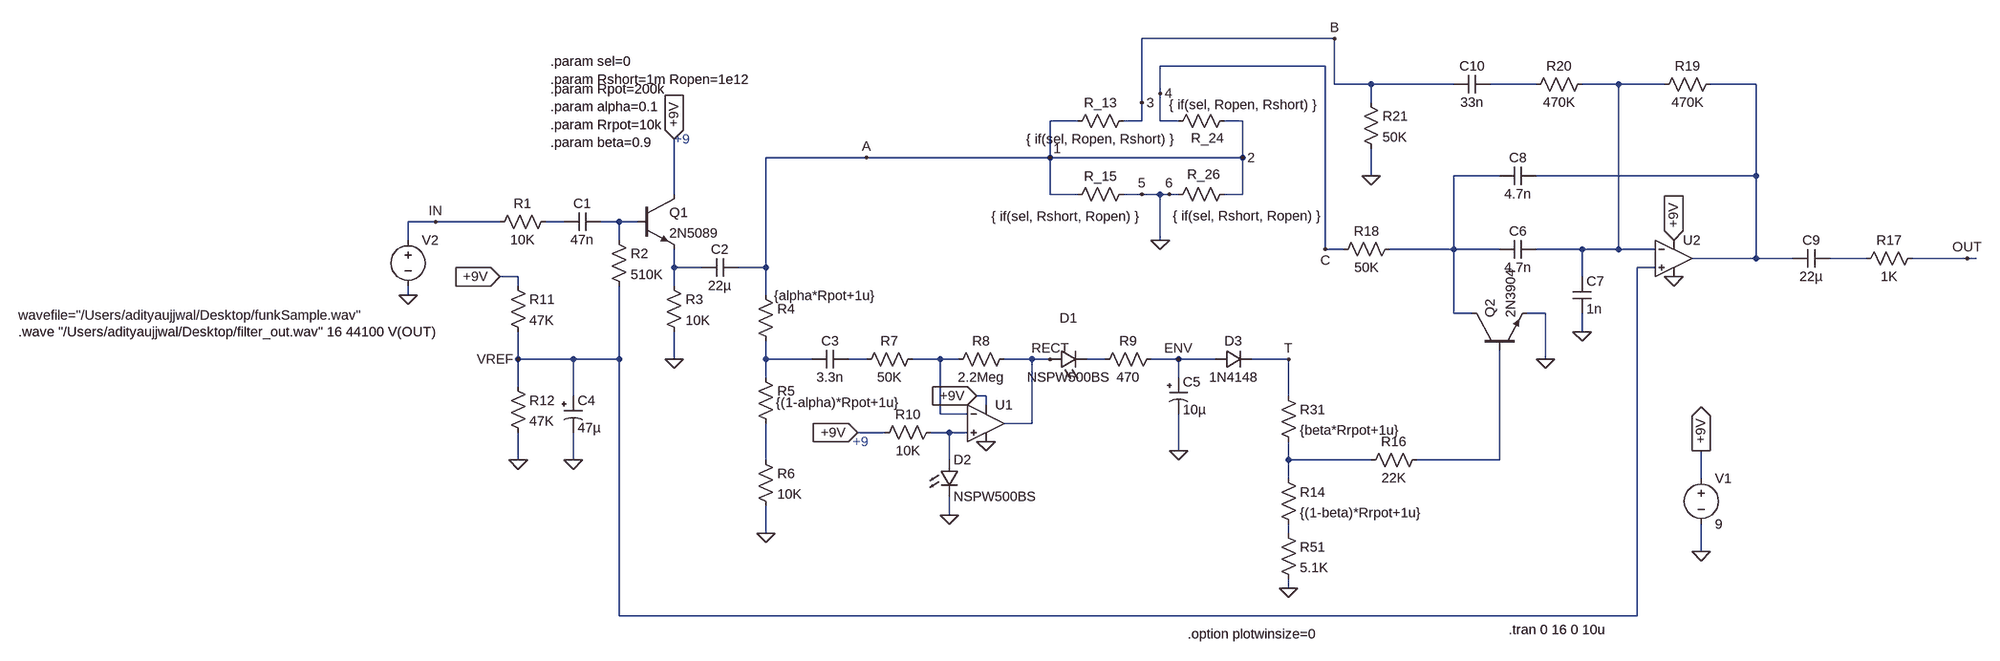
[diagram p0: schematic finalEnvelopeFilterPedal_LTSpice.asc]
finalEnvelopeFilterPedal_LTSpice.asc, the LTspice schematic file:
Version 4
SHEET 1 2632 932
WIRE 1456 -224 1120 -224
WIRE 1440 -176 1152 -176
WIRE 1456 -144 1456 -224
WIRE 1520 -144 1456 -144
WIRE 1664 -144 1520 -144
WIRE 1808 -144 1728 -144
WIRE 1952 -144 1888 -144
WIRE 2032 -144 1952 -144
WIRE 2192 -144 2112 -144
WIRE 1152 -128 1152 -176
WIRE 1120 -112 1120 -224
WIRE 1520 -112 1520 -144
WIRE 1008 -80 960 -80
WIRE 1120 -80 1120 -112
WIRE 1120 -80 1088 -80
WIRE 1152 -80 1152 -128
WIRE 1184 -80 1152 -80
WIRE 1296 -80 1264 -80
WIRE 640 -16 464 -16
WIRE 960 -16 960 -80
WIRE 960 -16 640 -16
WIRE 1296 -16 1296 -80
WIRE 1296 -16 960 -16
WIRE 1520 16 1520 -32
WIRE 1744 16 1664 16
WIRE 2192 16 2192 -144
WIRE 2192 16 1808 16
WIRE 304 48 304 -48
WIRE 960 48 960 -16
WIRE 1008 48 960 48
WIRE 1120 48 1088 48
WIRE 1152 48 1120 48
WIRE 1168 48 1152 48
WIRE 1184 48 1168 48
WIRE 1296 48 1296 -16
WIRE 1296 48 1264 48
WIRE -112 96 -160 96
WIRE 0 96 -112 96
WIRE 112 96 80 96
WIRE 208 96 176 96
WIRE 240 96 208 96
WIRE -160 128 -160 96
WIRE 208 128 208 96
WIRE 1152 128 1152 48
WIRE 1440 144 1440 -176
WIRE 1472 144 1440 144
WIRE 1664 144 1664 16
WIRE 1664 144 1552 144
WIRE 1744 144 1664 144
WIRE 1888 144 1808 144
WIRE 1952 144 1952 -144
WIRE 1952 144 1888 144
WIRE 2016 144 1952 144
WIRE 2192 160 2192 16
WIRE 2192 160 2080 160
WIRE 2256 160 2192 160
WIRE 2384 160 2320 160
WIRE 2560 160 2464 160
WIRE 2576 160 2560 160
WIRE 304 176 304 144
WIRE 352 176 304 176
WIRE 464 176 464 -16
WIRE 464 176 416 176
WIRE 2016 176 1984 176
WIRE 32 192 0 192
WIRE 1888 192 1888 144
WIRE 32 208 32 192
WIRE 304 208 304 176
WIRE -160 224 -160 208
WIRE 464 224 464 176
WIRE 1664 256 1664 144
WIRE 1696 256 1664 256
WIRE 1824 256 1792 256
WIRE 1888 288 1888 256
WIRE 32 336 32 288
WIRE 128 336 32 336
WIRE 208 336 208 208
WIRE 208 336 128 336
WIRE 304 336 304 288
WIRE 464 336 464 304
WIRE 544 336 464 336
WIRE 640 336 608 336
WIRE 768 336 720 336
WIRE 800 336 768 336
WIRE 928 336 880 336
WIRE 960 336 928 336
WIRE 1056 336 1024 336
WIRE 1184 336 1136 336
WIRE 1248 336 1184 336
WIRE 1376 336 1312 336
WIRE 1824 336 1824 256
WIRE 464 368 464 336
WIRE 1184 368 1184 336
WIRE 32 384 32 336
WIRE 128 400 128 336
WIRE 848 400 832 400
WIRE 1376 400 1376 336
WIRE 848 416 848 400
WIRE 768 432 768 336
WIRE 816 432 768 432
WIRE 928 448 928 336
WIRE 928 448 880 448
WIRE 672 464 624 464
WIRE 784 464 752 464
WIRE 816 464 784 464
WIRE 1184 496 1184 432
WIRE 32 512 32 464
WIRE 128 512 128 464
WIRE 464 512 464 448
WIRE 784 512 784 464
WIRE 1376 512 1376 480
WIRE 1520 512 1376 512
WIRE 1744 512 1744 320
WIRE 1744 512 1600 512
WIRE 1376 544 1376 512
WIRE 2096 544 2096 496
WIRE 784 608 784 576
WIRE 464 640 464 592
WIRE 1376 640 1376 624
WIRE 2096 672 2096 624
WIRE 1376 736 1376 720
WIRE 208 784 208 336
WIRE 1984 784 1984 176
WIRE 1984 784 208 784
FLAG 304 336 0
FLAG 464 640 0
FLAG 784 608 0
FLAG 32 512 0
FLAG 128 512 0
FLAG 1184 496 0
FLAG 1376 736 0
FLAG 1824 336 0
FLAG 1888 288 0
FLAG 1520 16 0
FLAG 1152 128 0
FLAG 640 -16 A
FLAG 960 -16 1
FLAG 1296 -16 2
FLAG 1120 48 5
FLAG 1168 48 6
FLAG 1120 -112 3
FLAG 1152 -128 4
FLAG 1440 144 C
FLAG 1456 -224 B
FLAG 0 192 +9V
IOPIN 0 192 In
FLAG 304 -48 +9V
IOPIN 304 -48 In
FLAG 624 464 +9V
IOPIN 624 464 In
FLAG 2096 672 0
FLAG 2096 496 +9V
IOPIN 2096 496 Out
FLAG 848 480 0
FLAG 2048 192 0
FLAG 832 400 +9V
IOPIN 832 400 In
FLAG 2048 128 +9V
IOPIN 2048 128 In
FLAG 32 336 VREF
FLAG 1184 336 ENV
FLAG 960 336 RECT
FLAG 1376 336 T
FLAG -160 224 0
FLAG 2560 160 OUT
FLAG -112 96 IN
SYMBOL Res 96 80 R90
WINDOW 0 0 56 VBottom 2
WINDOW 3 32 56 VTop 2
SYMATTR InstName R1
SYMATTR Value 10K
SYMBOL Cap 176 80 R90
WINDOW 0 0 32 VBottom 2
WINDOW 3 32 32 VTop 2
SYMATTR InstName C1
SYMATTR Value 47n
SYMBOL npn2 240 48 R0
SYMATTR InstName Q1
SYMATTR Value 2N5089
SYMBOL Res 192 112 R0
SYMATTR InstName R2
SYMATTR Value 510K
SYMBOL Res 288 192 R0
SYMATTR InstName R3
SYMATTR Value 10K
SYMBOL Cap 416 160 R90
WINDOW 0 0 32 VBottom 2
WINDOW 3 32 32 VTop 2
SYMATTR InstName C2
SYMATTR Value 22µ
SYMBOL Res 448 208 R0
WINDOW 3 30 17 Left 2
SYMATTR Value {alpha*Rpot+1u}
SYMATTR InstName R4
SYMBOL Res 448 352 R0
WINDOW 3 34 60 Left 2
SYMATTR Value {(1-alpha)*Rpot+1u}
SYMATTR InstName R5
SYMBOL Res 448 496 R0
SYMATTR InstName R6
SYMATTR Value 10K
SYMBOL Cap 608 320 R90
WINDOW 0 0 32 VBottom 2
WINDOW 3 32 32 VTop 2
SYMATTR InstName C3
SYMATTR Value 3.3n
SYMBOL Res 736 320 R90
WINDOW 0 0 56 VBottom 2
WINDOW 3 32 56 VTop 2
SYMATTR InstName R7
SYMATTR Value 50K
SYMBOL Res 896 320 R90
WINDOW 0 0 56 VBottom 2
WINDOW 3 32 56 VTop 2
SYMATTR InstName R8
SYMATTR Value 2.2Meg
SYMBOL LED 960 352 R270
WINDOW 0 72 32 VTop 2
WINDOW 3 0 32 VBottom 2
SYMATTR InstName D1
SYMATTR Value NSPW500BS
SYMBOL Res 1152 320 R90
WINDOW 0 0 56 VBottom 2
WINDOW 3 32 56 VTop 2
SYMATTR InstName R9
SYMATTR Value 470
SYMBOL OpAmps/UniversalOpAmp2 848 448 R0
SYMATTR InstName U1
SYMBOL Res 768 448 R90
WINDOW 0 0 56 VBottom 2
WINDOW 3 32 56 VTop 2
SYMATTR InstName R10
SYMATTR Value 10K
SYMBOL LED 768 512 R0
SYMATTR InstName D2
SYMATTR Value NSPW500BS
SYMBOL Res 16 192 R0
SYMATTR InstName R11
SYMATTR Value 47K
SYMBOL Res 16 368 R0
SYMATTR InstName R12
SYMATTR Value 47K
SYMBOL polcap 112 400 R0
WINDOW 3 24 56 Left 2
SYMATTR Value 47µ
SYMATTR InstName C4
SYMATTR Description Capacitor
SYMATTR Type cap
SYMATTR SpiceLine Rser=18m Lser=0 mfg="KEMET" pn="A700V476M006ATE018" type="Al electrolytic"
SYMBOL polcap 1168 368 R0
WINDOW 3 24 56 Left 2
SYMATTR Value 10µ
SYMATTR InstName C5
SYMATTR Description Capacitor
SYMATTR Type cap
SYMATTR SpiceLine Rser=55m Lser=0 mfg="KEMET" pn="A700V106M006ATE055" type="Al electrolytic"
SYMBOL Res 1360 384 R0
SYMATTR InstName R31
SYMATTR Value {beta*Rrpot+1u}
SYMBOL Res 1360 528 R0
SYMATTR InstName R14
SYMATTR Value {(1-beta)*Rrpot+1u}
SYMBOL Res 1360 624 R0
SYMATTR InstName R51
SYMATTR Value 5.1K
SYMBOL Res 1616 496 R90
WINDOW 0 0 56 VBottom 2
WINDOW 3 32 56 VTop 2
SYMATTR InstName R16
SYMATTR Value 22K
SYMBOL npn2 1696 320 R270
SYMATTR InstName Q2
SYMATTR Value 2N3904
SYMBOL Cap 1808 128 R90
WINDOW 0 0 32 VBottom 2
WINDOW 3 32 32 VTop 2
SYMATTR InstName C6
SYMATTR Value 4.7n
SYMBOL Cap 1872 192 R0
SYMATTR InstName C7
SYMATTR Value 1n
SYMBOL OpAmps/UniversalOpAmp2 2048 160 R0
SYMATTR InstName U2
SYMBOL Cap 1808 0 R90
WINDOW 0 0 32 VBottom 2
WINDOW 3 32 32 VTop 2
SYMATTR InstName C8
SYMATTR Value 4.7n
SYMBOL Cap 2320 144 R90
WINDOW 0 0 32 VBottom 2
WINDOW 3 32 32 VTop 2
SYMATTR InstName C9
SYMATTR Value 22µ
SYMBOL Res 2480 144 R90
WINDOW 0 0 56 VBottom 2
WINDOW 3 32 56 VTop 2
SYMATTR InstName R17
SYMATTR Value 1K
SYMBOL Res 1568 128 R90
WINDOW 0 0 56 VBottom 2
WINDOW 3 32 56 VTop 2
SYMATTR InstName R18
SYMATTR Value 50K
SYMBOL Res 2128 -160 R90
WINDOW 0 0 56 VBottom 2
WINDOW 3 32 56 VTop 2
SYMATTR InstName R19
SYMATTR Value 470K
SYMBOL Res 1904 -160 R90
WINDOW 0 0 56 VBottom 2
WINDOW 3 32 56 VTop 2
SYMATTR InstName R20
SYMATTR Value 470K
SYMBOL Cap 1728 -160 R90
WINDOW 0 0 32 VBottom 2
WINDOW 3 32 32 VTop 2
SYMATTR InstName C10
SYMATTR Value 33n
SYMBOL Res 1504 -128 R0
SYMATTR InstName R21
SYMATTR Value 50K
SYMBOL Res 1104 -96 R90
WINDOW 0 0 56 VBottom 2
WINDOW 3 32 56 VTop 2
SYMATTR InstName R_13
SYMATTR Value { if(sel, Ropen, Rshort) }
SYMBOL Res 1280 -96 R90
WINDOW 0 62 45 VBottom 2
WINDOW 3 -28 -17 VTop 2
SYMATTR InstName R_24
SYMATTR Value { if(sel, Ropen, Rshort) }
SYMBOL Res 1104 32 R90
WINDOW 0 0 56 VBottom 2
WINDOW 3 39 117 VTop 2
SYMATTR InstName R_15
SYMATTR Value { if(sel, Rshort, Ropen) }
SYMBOL Res 1280 32 R90
WINDOW 0 -3 52 VBottom 2
WINDOW 3 38 -24 VTop 2
SYMATTR InstName R_26
SYMATTR Value { if(sel, Rshort, Ropen) }
SYMBOL Voltage 2096 528 R0
SYMATTR InstName V1
SYMATTR Value 9
SYMBOL diode 1248 352 R270
WINDOW 0 32 32 VTop 2
WINDOW 3 0 32 VBottom 2
SYMATTR InstName D3
SYMATTR Value 1N4148
SYMBOL voltage -160 112 R0
WINDOW 3 -680 147 Left 2
SYMATTR Value wavefile="/Users/adityaujjwal/Desktop/funkSample.wav"
SYMATTR InstName V2
TEXT 616 480 Left 2 ;+9
TEXT 304 -48 Left 2 ;+9
TEXT 88 -136 Left 2 !.param Rpot=200k\n.param alpha=0.1\n.param Rrpot=10k\n.param beta=0.9
TEXT 88 -184 Left 2 !.param sel=0\n.param Rshort=1m Ropen=1e12
TEXT 1760 808 Left 2 !.tran 0 16 0 10u
TEXT 1200 816 Left 2 !.option plotwinsize=0
TEXT -840 288 Left 2 !.wave "/Users/adityaujjwal/Desktop/filter_out.wav" 16 44100 V(OUT)

The netlist it stands for:
* finalEnvelopeFilterPedal_LTSpice.asc
R1 N005 IN 10K
C1 N006 N005 47n
Q1 +9V N006 N008 0 2N5089
R2 N006 VREF 510K
R3 N008 0 10K
C2 2 N008 22µ
R4 2 N009 {alpha*Rpot+1u}
R5 N009 N014 {(1-alpha)*Rpot+1u}
R6 N014 0 10K
C3 N010 N009 3.3n
R7 N011 N010 50K
R8 RECT N011 2.2Meg
D1 RECT N012 NSPW500BS
R9 ENV N012 470
XU1 N013 N011 +9V 0 RECT level2 Avol=1Meg GBW=10Meg Slew=10Meg Ilimit=25m Rail=0 Vos=0 En=0 Enk=0 In=0 Ink=0 Rin=500Meg  ; pins In+ In- V+ V- OUT
R10 N013 +9V 10K
D2 N013 0 NSPW500BS
R11 +9V VREF 47K
R12 VREF 0 47K
C4 VREF 0 47µ Rser=18m Lser=0 mfg="KEMET" pn="A700V476M006ATE018" type="Al electrolytic"
C5 ENV 0 10µ Rser=55m Lser=0 mfg="KEMET" pn="A700V106M006ATE055" type="Al electrolytic"
R31 T N015 {beta*Rrpot+1u}
R14 N015 N017 {(1-beta)*Rrpot+1u}
R51 N017 0 5.1K
R16 N016 N015 22K
Q2 N004 N016 0 0 2N3904
C6 N002 N004 4.7n
C7 N002 0 1n
XU2 VREF N002 +9V 0 N003 level2 Avol=1Meg GBW=10Meg Slew=10Meg Ilimit=25m Rail=0 Vos=0 En=0 Enk=0 In=0 Ink=0 Rin=500Meg  ; pins In+ In- V+ V- OUT
C8 N003 N004 4.7n
C9 N007 N003 22µ
R17 OUT N007 1K
R18 N004 C 50K
R19 N003 N002 470K
R20 N002 N001 470K
C10 N001 B 33n
R21 B 0 50K
R_13 B 2 { if(sel, Ropen, Rshort) }
R_24 2 C { if(sel, Ropen, Rshort) }
R_15 0 2 { if(sel, Rshort, Ropen) }
R_26 2 0 { if(sel, Rshort, Ropen) }
V1 +9V 0 9
D3 ENV T 1N4148
V2 IN 0 wavefile="/Users/adityaujjwal/Desktop/funkSample.wav"
.model D D
.lib standard.dio
.model NPN NPN
.model PNP PNP
.lib standard.bjt
* +9
* +9
.param Rpot=200k
.param alpha=0.1
.param Rrpot=10k
.param beta=0.9
.param sel=0
.param Rshort=1m Ropen=1e12
.tran 0 16 0 10u
.option plotwinsize=0
.wave "/Users/adityaujjwal/Desktop/filter_out.wav" 16 44100 V(OUT)
.lib UniversalOpAmp2.lib
.backanno
.end